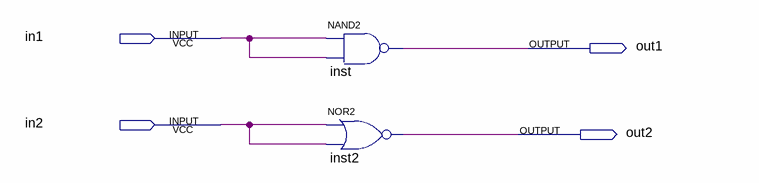
[diagram p0: schematic sheet]
// Quartus schematic nand1.bdf as structural Verilog: 2 symbols, 4 pins
module nand1 (
  input  in1,
  input  in2,
  output out1,
  output out2
);

  nand inst (out1, in1, in1);
  nor inst2 (out2, in2, in2);
endmodule
